# Altium schematic sheet RMD6300.SchDoc
size A
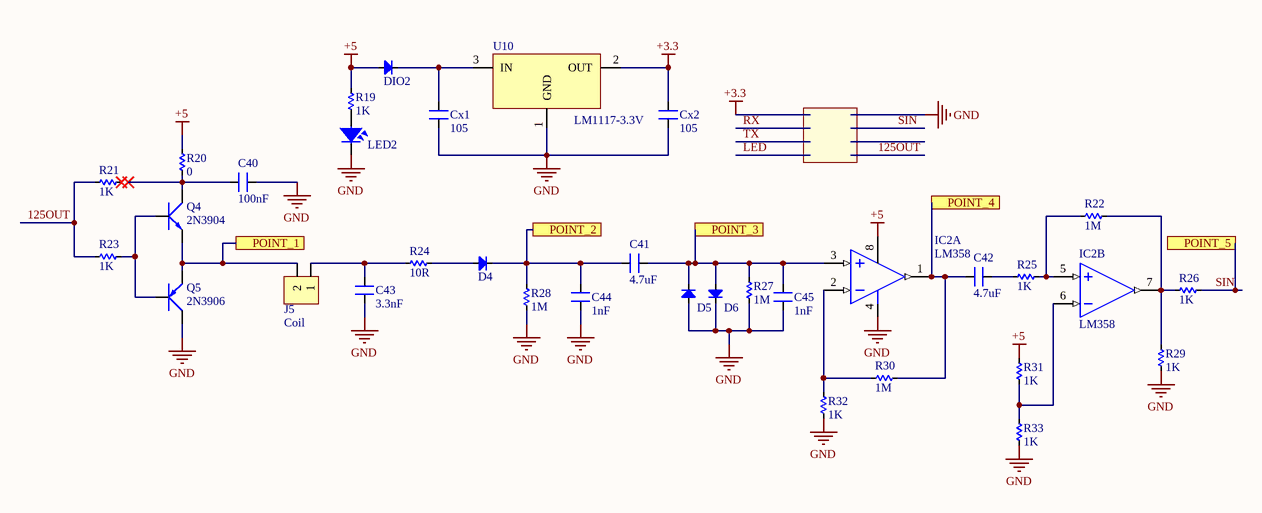
[diagram p0: RMD6300.SchDoc]

## Parts
C40  100nF  [CN1.5]
C41  4.7uF  [CN1.5]
C42  4.7uF  [CN1.5]
C43  3.3nF  [CN1.5]
C44  1nF  [CN1.5]
C45  1nF  [CN1.5]
Cx1  105  [CN1.5]
Cx2  105  [CN1.5]
D4  1n4148  [DIO-SMD-106]  (value not drawn)
D5  1n4148  [DIO-SMD-106]  (value not drawn)
D6  1n4148  [DIO-SMD-106]  (value not drawn)
DIO2  Diode SMD  [DIO-SMD-106]  (value not drawn)
IC2  LM358  [DIP8]  (parts A,B of 2)
J5  Coil  [HDR2]
LED2  LED  [LED-3MM-YELLOW]  (value not drawn)
Q4  2N3904  [TO92-123]
Q5  2N3906  [TO92-123]
R19  1K  [RES-SMD-0101]
R20  0  [RES-SMD-0101]
R21  1K  [RES-SMD-0101]
R22  1M  [RES-SMD-0101]
R23  1K  [RES-SMD-0101]
R24  10R  [RES-SMD-0101]
R25  1K  [RES-SMD-0101]
R26  1K  [RES-SMD-0101]
R27  1M  [RES-SMD-0101]
R28  1M  [RES-SMD-0101]
R29  1K  [RES-SMD-0101]
R30  1M  [RES-SMD-0101]
R31  1K  [RES-SMD-0101]
R32  1K  [RES-SMD-0101]
R33  1K  [RES-SMD-0101]
U10  LM1117-3.3V  [SOT223]

## Ports
POINT_1, POINT_2, POINT_3, POINT_4, POINT_5

## Nets
+3.3: Cx2.2 U10.2(OUT)
+5: DIO2.1(A) IC2.8(+V) R19.1 R20.1 R31.1
GND: C40.1 C43.2 C44.2 C45.2 Cx1.1 Cx2.1 D5.1(A) D6.2(K) IC2.4(-V) LED2.2 Q5.3(C) R27.1 R28.1 R29.2 R32.1 R33.2 U10.1(GND)
125OUT: R21.1 R23.1
POINT_1: J5.2 Q4.1(E) Q5.1(E) ; port POINT_1
POINT_2: C41.1 C44.1 D4.2(K) R28.2 ; port POINT_2
POINT_3: C41.2 C45.1 D5.2(K) D6.1(A) IC2.3(IN+) R27.2 ; port POINT_3
POINT_4: C42.1 IC2.1(OUT) R30.1 ; port POINT_4
SIN: R26.1 ; port POINT_5
NetC40_2: C40.2 Q4.3(C) R20.2
NetC42_2: C42.2 R25.2
NetC43_1: C43.1 J5.1 R24.1
NetCx1_2: Cx1.2 DIO2.2(K) U10.3(IN)
NetD4_1: D4.1(A) R24.2
NetIC2_2: IC2.2(IN-) R30.2 R32.2
NetIC2_5: IC2.5(IN+) R22.2 R25.1
NetIC2_6: IC2.6(IN-) R31.2 R33.1
NetIC2_7: IC2.7(OUT) R22.1 R26.2 R29.1
NetLED2_1: LED2.1 R19.2
NetQ4_2: Q4.2(B) Q5.2(B) R23.2

Not connected (* = marked no-connect by the designer): R21 2*

## Library data of the parts
C40-C45 Cx1 Cx2 = CN: Value: 33pF
D4-D6 DIO2 = Diode SMD: Default Diode; Code - JEDEC: DO-214-AB; Value: 1N5007; Published: 8-Jun-2000; Revision: July-2002: Re-released for DXP Platform.; Publisher: Altium Limited
IC2 = LM358: Low-Power Dual Operational Amplifier; Value: LM358
J5 = Header2: Header IDC, 2 x 1 Pin Vertical 2.54mm Pitch (Non-Boxed, Male); Manufacturer: W¨¹rth Elektronik eiSos GmbH; partNo: 613002143121; ComponentLink1 Description: Manufacturer; ComponentLink2 Description: Datasheet; NoPins: 02; Created Date: 29 March 2013; ComponentLink1URL: http://www.we-online.com; ComponentLink2URL: http://katalog.we-online.de/em/datasheet/6130xx143121.pdf; Created by: Karrer Zheng
LED2 = LED: LED Single colour Green and Red; Value: LED 3 ly Single Colour
Q4 = 2N904: NPN 600mW, ECB; Value: C1815
Q5 = 2N3906: PNP 600mW, ECB; Value: A1015
R19-R33 = Res-SMD: Resistor; Manufacturer: Generic Components; Class: Passive; Published: 08/06/2000; Publisher: Altium Hobart Technology Centre
U10 = LM1117: 800mA Low-Dropout Linear Regulator; Creator: Nguyen Ba Bien; Website: http://group3i.net